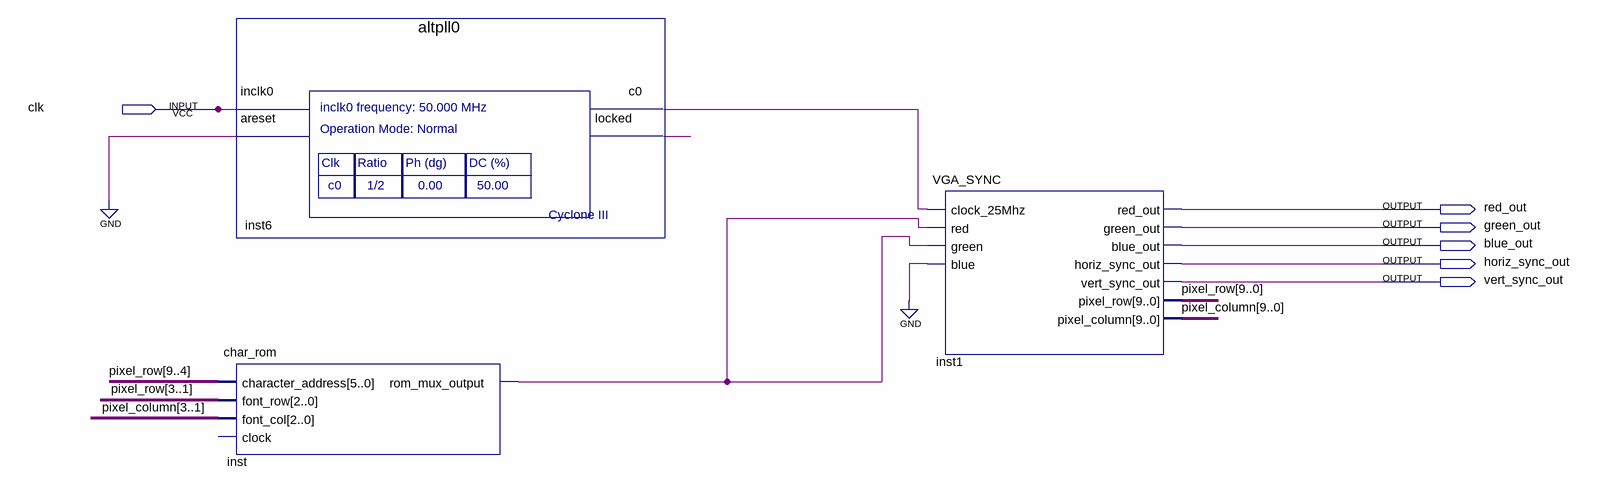
[diagram p0: schematic sheet]
// Quartus schematic testText.bdf as structural Verilog: 3 symbols, 6 pins
module testText (
  input  clk,
  output red_out,
  output green_out,
  output blue_out,
  output horiz_sync_out,
  output vert_sync_out
);

  wire inst6_c0, inst6_locked, inst_rom_mux_output;
  wire [9:0] pixel_column, pixel_row;

  altpll0 inst6 (.inclk0(clk), .areset(1'b0), .c0(inst6_c0), .locked(inst6_locked));
  char_rom inst (
    .character_address(pixel_row[9:4]), .font_row(pixel_row[3:1]), .font_col(pixel_column[3:1]),
    .rom_mux_output(inst_rom_mux_output));  // open: clock
  VGA_SYNC inst1 (
    .clock_25Mhz(inst6_c0), .red(inst_rom_mux_output), .green(inst_rom_mux_output), .blue(1'b0),
    .red_out(red_out), .green_out(green_out), .blue_out(blue_out), .horiz_sync_out(horiz_sync_out),
    .vert_sync_out(vert_sync_out), .pixel_row(pixel_row), .pixel_column(pixel_column));
endmodule
